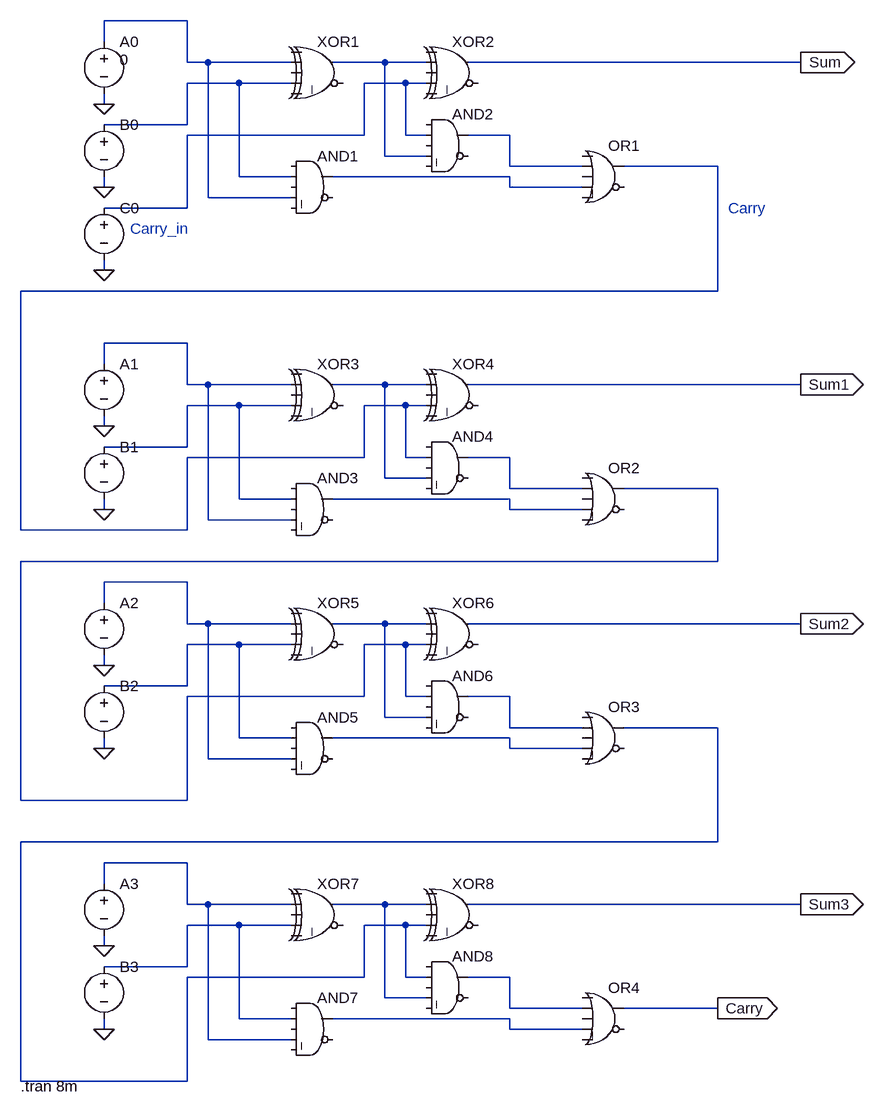
[diagram p0: schematic 4_bit_binary_calculator.asc]
4_bit_binary_calculator.asc, the LTspice schematic file:
Version 4.1
SHEET 1 988 1672
WIRE -80 16 -208 16
WIRE -208 48 -208 16
WIRE -80 80 -80 16
WIRE -48 80 -80 80
WIRE 80 80 -48 80
WIRE 224 80 144 80
WIRE 288 80 224 80
WIRE 864 80 352 80
WIRE 0 112 -80 112
WIRE 80 112 0 112
WIRE 256 112 192 112
WIRE 288 112 256 112
WIRE -208 144 -208 128
WIRE -80 176 -80 112
WIRE -80 176 -208 176
WIRE 192 192 192 112
WIRE 192 192 -80 192
WIRE 256 192 256 112
WIRE 288 192 256 192
WIRE 416 192 352 192
WIRE 224 224 224 80
WIRE 288 224 224 224
WIRE 416 240 416 192
WIRE 528 240 416 240
WIRE 736 240 592 240
WIRE 0 256 0 112
WIRE 80 256 0 256
WIRE 416 256 144 256
WIRE -208 272 -208 256
WIRE 416 272 416 256
WIRE 528 272 416 272
WIRE -48 288 -48 80
WIRE 80 288 -48 288
WIRE -80 304 -80 192
WIRE -80 304 -208 304
WIRE -208 400 -208 384
WIRE 736 432 736 240
WIRE 736 432 -336 432
WIRE -80 512 -208 512
WIRE -208 544 -208 512
WIRE -80 576 -80 512
WIRE -48 576 -80 576
WIRE 80 576 -48 576
WIRE 224 576 144 576
WIRE 288 576 224 576
WIRE 864 576 352 576
WIRE 0 608 -80 608
WIRE 80 608 0 608
WIRE 256 608 192 608
WIRE 288 608 256 608
WIRE -208 640 -208 624
WIRE -80 672 -80 608
WIRE -80 672 -208 672
WIRE 192 688 192 608
WIRE 192 688 -80 688
WIRE 256 688 256 608
WIRE 288 688 256 688
WIRE 416 688 352 688
WIRE 224 720 224 576
WIRE 288 720 224 720
WIRE 416 736 416 688
WIRE 528 736 416 736
WIRE 736 736 592 736
WIRE 0 752 0 608
WIRE 80 752 0 752
WIRE 416 752 144 752
WIRE -208 768 -208 752
WIRE 416 768 416 752
WIRE 528 768 416 768
WIRE -48 784 -48 576
WIRE 80 784 -48 784
WIRE -336 800 -336 432
WIRE -80 800 -80 688
WIRE -80 800 -336 800
WIRE 736 848 736 736
WIRE 736 848 -336 848
WIRE -80 880 -208 880
WIRE -208 912 -208 880
WIRE -80 944 -80 880
WIRE -48 944 -80 944
WIRE 80 944 -48 944
WIRE 224 944 144 944
WIRE 288 944 224 944
WIRE 864 944 352 944
WIRE 0 976 -80 976
WIRE 80 976 0 976
WIRE 256 976 192 976
WIRE 288 976 256 976
WIRE -208 1008 -208 992
WIRE -80 1040 -80 976
WIRE -80 1040 -208 1040
WIRE 192 1056 192 976
WIRE 192 1056 -80 1056
WIRE 256 1056 256 976
WIRE 288 1056 256 1056
WIRE 416 1056 352 1056
WIRE 224 1088 224 944
WIRE 288 1088 224 1088
WIRE 416 1104 416 1056
WIRE 528 1104 416 1104
WIRE 736 1104 592 1104
WIRE 0 1120 0 976
WIRE 80 1120 0 1120
WIRE 416 1120 144 1120
WIRE -208 1136 -208 1120
WIRE 416 1136 416 1120
WIRE 528 1136 416 1136
WIRE -48 1152 -48 944
WIRE 80 1152 -48 1152
WIRE -336 1216 -336 848
WIRE -80 1216 -80 1056
WIRE -80 1216 -336 1216
WIRE 736 1280 736 1104
WIRE 736 1280 -336 1280
WIRE -80 1312 -208 1312
WIRE -208 1344 -208 1312
WIRE -80 1376 -80 1312
WIRE -48 1376 -80 1376
WIRE 80 1376 -48 1376
WIRE 224 1376 144 1376
WIRE 288 1376 224 1376
WIRE 864 1376 352 1376
WIRE 0 1408 -80 1408
WIRE 80 1408 0 1408
WIRE 256 1408 192 1408
WIRE 288 1408 256 1408
WIRE -208 1440 -208 1424
WIRE -80 1472 -80 1408
WIRE -80 1472 -208 1472
WIRE 192 1488 192 1408
WIRE 192 1488 -80 1488
WIRE 256 1488 256 1408
WIRE 288 1488 256 1488
WIRE 416 1488 352 1488
WIRE 224 1520 224 1376
WIRE 288 1520 224 1520
WIRE 416 1536 416 1488
WIRE 528 1536 416 1536
WIRE 736 1536 592 1536
WIRE 0 1552 0 1408
WIRE 80 1552 0 1552
WIRE 416 1552 144 1552
WIRE -208 1568 -208 1552
WIRE 416 1568 416 1552
WIRE 528 1568 416 1568
WIRE -48 1584 -48 1376
WIRE 80 1584 -48 1584
WIRE -336 1648 -336 1280
WIRE -80 1648 -80 1488
WIRE -80 1648 -336 1648
FLAG -208 144 0
FLAG -208 272 0
FLAG -208 400 0
FLAG 864 80 Sum
IOPIN 864 80 Out
FLAG -208 640 0
FLAG -208 768 0
FLAG 864 576 Sum1
IOPIN 864 576 Out
FLAG -208 1008 0
FLAG -208 1136 0
FLAG 864 944 Sum2
IOPIN 864 944 Out
FLAG -208 1440 0
FLAG -208 1568 0
FLAG 864 1376 Sum3
IOPIN 864 1376 Out
FLAG 736 1536 Carry
IOPIN 736 1536 Out
SYMBOL Digital\\xor 128 32 R0
SYMATTR InstName XOR1
SYMBOL Digital\\xor 336 32 R0
SYMATTR InstName XOR2
SYMBOL Digital\\and 112 208 R0
SYMATTR InstName AND1
SYMBOL Digital\\and 320 144 R0
SYMATTR InstName AND2
SYMBOL Digital\\or 560 192 R0
SYMATTR InstName OR1
SYMBOL voltage -208 32 R0
WINDOW 3 24 44 Left 2
WINDOW 123 0 0 Left 0
WINDOW 39 0 0 Left 0
SYMATTR Value 0
SYMATTR InstName A0
SYMBOL voltage -208 160 R0
WINDOW 3 24 96 Invisible 1
WINDOW 123 0 0 Left 0
WINDOW 39 0 0 Left 0
SYMATTR Value 0
SYMATTR InstName B0
SYMBOL voltage -208 288 R0
WINDOW 3 24 96 Invisible 1
WINDOW 123 0 0 Left 0
WINDOW 39 0 0 Left 0
SYMATTR Value 0
SYMATTR InstName C0
SYMBOL Digital\\xor 128 528 R0
SYMATTR InstName XOR3
SYMBOL Digital\\xor 336 528 R0
SYMATTR InstName XOR4
SYMBOL Digital\\and 112 704 R0
SYMATTR InstName AND3
SYMBOL Digital\\and 320 640 R0
SYMATTR InstName AND4
SYMBOL Digital\\or 560 688 R0
SYMATTR InstName OR2
SYMBOL voltage -208 528 R0
WINDOW 3 24 96 Invisible 2
WINDOW 123 0 0 Left 0
WINDOW 39 0 0 Left 0
SYMATTR Value 1
SYMATTR InstName A1
SYMBOL voltage -208 656 R0
WINDOW 3 24 96 Invisible 2
WINDOW 123 0 0 Left 0
WINDOW 39 0 0 Left 0
SYMATTR Value 1
SYMATTR InstName B1
SYMBOL Digital\\xor 128 896 R0
SYMATTR InstName XOR5
SYMBOL Digital\\xor 336 896 R0
SYMATTR InstName XOR6
SYMBOL Digital\\and 112 1072 R0
SYMATTR InstName AND5
SYMBOL Digital\\and 320 1008 R0
SYMATTR InstName AND6
SYMBOL Digital\\or 560 1056 R0
SYMATTR InstName OR3
SYMBOL voltage -208 896 R0
WINDOW 3 24 96 Invisible 2
WINDOW 123 0 0 Left 0
WINDOW 39 0 0 Left 0
SYMATTR Value 0
SYMATTR InstName A2
SYMBOL voltage -208 1024 R0
WINDOW 3 24 96 Invisible 2
WINDOW 123 0 0 Left 0
WINDOW 39 0 0 Left 0
SYMATTR Value 0
SYMATTR InstName B2
SYMBOL Digital\\xor 128 1328 R0
SYMATTR InstName XOR7
SYMBOL Digital\\xor 336 1328 R0
SYMATTR InstName XOR8
SYMBOL Digital\\and 112 1504 R0
SYMATTR InstName AND7
SYMBOL Digital\\and 320 1440 R0
SYMATTR InstName AND8
SYMBOL Digital\\or 560 1488 R0
SYMATTR InstName OR4
SYMBOL voltage -208 1328 R0
WINDOW 3 24 96 Invisible 2
WINDOW 123 0 0 Left 0
WINDOW 39 0 0 Left 0
SYMATTR Value 1
SYMATTR InstName A3
SYMBOL voltage -208 1456 R0
WINDOW 3 24 96 Invisible 2
WINDOW 123 0 0 Left 0
WINDOW 39 0 0 Left 0
SYMATTR Value 1
SYMATTR InstName B3
TEXT 752 304 Left 2 ;Carry
TEXT -168 336 Left 2 ;Carry_in
TEXT -336 1656 Left 2 !.tran 8m

The netlist it stands for:
* 4_bit_binary_calculator.asc
A§XOR1 0 N001 0 N003 0 0 N002 0 XOR
A§XOR2 0 N002 0 N004 0 0 Sum 0 XOR
AND1 0 N003 0 N001 0 0 N007 0 AND
AND2 0 N004 0 N002 0 0 N005 0 AND
A§OR1 0 N005 0 N007 0 0 N006 0 OR
V§A0 N001 0 0
V§B0 N003 0 0
V§C0 N004 0 0
A§XOR3 0 N008 0 N010 0 0 N009 0 XOR
A§XOR4 0 N009 0 N006 0 0 Sum1 0 XOR
AND3 0 N010 0 N008 0 0 N013 0 AND
AND4 0 N006 0 N009 0 0 N011 0 AND
A§OR2 0 N011 0 N013 0 0 N012 0 OR
V§A1 N008 0 1
V§B1 N010 0 1
A§XOR5 0 N014 0 N016 0 0 N015 0 XOR
A§XOR6 0 N015 0 N012 0 0 Sum2 0 XOR
AND5 0 N016 0 N014 0 0 N019 0 AND
AND6 0 N012 0 N015 0 0 N017 0 AND
A§OR3 0 N017 0 N019 0 0 N018 0 OR
V§A2 N014 0 0
V§B2 N016 0 0
A§XOR7 0 N020 0 N022 0 0 N021 0 XOR
A§XOR8 0 N021 0 N018 0 0 Sum3 0 XOR
AND7 0 N022 0 N020 0 0 N024 0 AND
AND8 0 N018 0 N021 0 0 N023 0 AND
A§OR4 0 N023 0 N024 0 0 Carry 0 OR
V§A3 N020 0 1
V§B3 N022 0 1
* Carry
* Carry_in
.tran 8m
.backanno
.end